# EAGLE schematic F7BNJ6PIJVPUCS8 (EAGLE 7.3.0)
COPYRIGHT: based on Transistortester (microcontroller.net); PROJECT_INFO: extented version with backlight dimmer; PROJECT_NAME: Component Tester
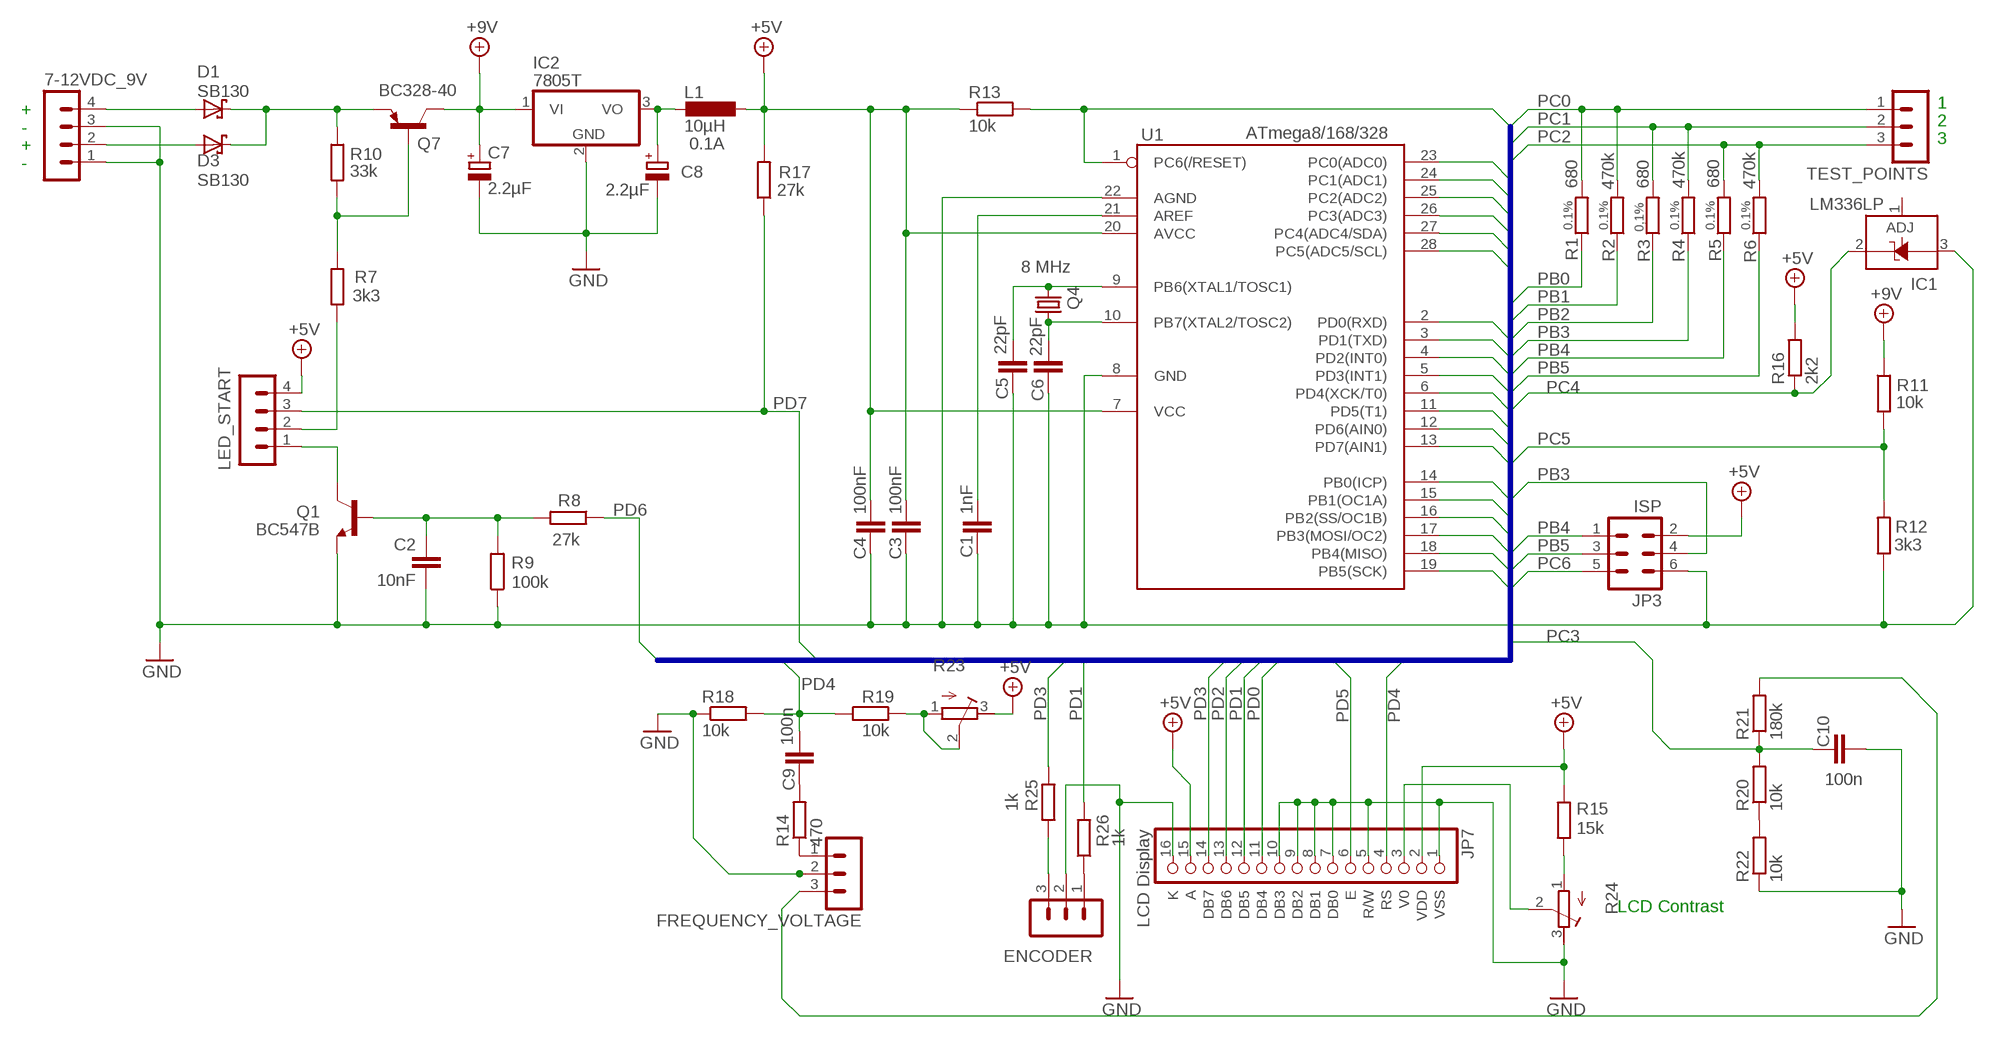
[diagram p0: schematic, sheet 1]

## Parts
7-12VDC_9V  MA04-1  [MA04-1]
C1  1nF  C2.5/2  [C2.5-2]
C2  10nF  C2,5-3  [C2.5-3]
C3  100nF  C-EU025-025X050  [C025-025X050]
C4  100nF  C-EU025-025X050  [C025-025X050]
C5  22pF  C2,5-3  [C2.5-3]
C6  22pF  C2,5-3  [C2.5-3]
C7  2.2µF  CPOL-EUE5-5  [E5-5]
C8  2.2µF  CPOL-EUE5-5  [E5-5]
C9  100n  C2,5-3  [C2.5-3]
C10  100n  C2,5-3  [C2.5-3]
D1  SB130  SCHOTTKY-DIODE_RAD3-5-A  [DIODE-3-5A-V]
D3  SB130  SCHOTTKY-DIODE_RAD3-5-A  [DIODE-3-5A-V]
ENCODER  MA03-1  [MA03-1]
FREQUENCY_VOLTAGE  MA03-1  [MA03-1]
IC1  LM336LP  [TO92]
IC2  7805T  [TO220H]
JP3  ISP  ML6  [ML6]
JP7  LCD Display  PINHD-1X16-LCD-TOP  [PINHD-1X16]
L1  10µH  L-EU0204/7  [0204/7]
LED_START  MA04-1  [MA04-1]
Q1  BC547B  [TO92]
Q4  8 MHz  CRYSTALHC49S  [HC49/S]
Q7  BC328-40  [TO92-EBC]
R1  680  R-EU_0207/10  [0207/10]
R2  470k  R-EU_0207/10  [0207/10]
R3  680  R-EU_0207/10  [0207/10]
R4  470k  R-EU_0207/10  [0207/10]
R5  680  R-EU_0207/10  [0207/10]
R6  470k  R-EU_0207/10  [0207/10]
R7  3k3  R-EU_0207/10  [0207/10]
R8  27k  R-EU_0204/7  [0204/7]
R9  100k  R-EU_0204/7  [0204/7]
R10  33k  R-EU_0207/2V  [0207/2V]
R11  10k  R-EU_0207/10  [0207/10]
R12  3k3  R-EU_0207/2V  [0207/2V]
R13  10k  R-EU_0207/10  [0207/10]
R14  470  R-EU_0207/10  [0207/10]
R15  15k  R-EU_0207/10  [0207/10]
R16  2k2  R-EU_0204/5  [0204/5]
R17  27k  R-EU_0207/7  [0207/7]
R18  10k  R-EU_0207/10  [0207/10]
R19  10k  R-EU_0207/10  [0207/10]
R20  10k  R-EU_0207/10  [0207/10]
R21  180k  R-EU_0207/10  [0207/10]
R22  10k  R-EU_0207/10  [0207/10]
R23  R-TRIMM3339P  [RTRIM3339P]
R24  R-TRIMM3339P  [RTRIM3339P]
R25  1k  R-EU_0204/7  [0204/7]
R26  1k  R-EU_0207/10  [0207/10]
TEST_POINTS  MA03-1  [MA03-1]
U1  ATmega8/168/328  MEGA8-P  [DIL28-3]

## Nets
+5V: C3.2 C4.1 JP3.2 JP7.2(VDD) JP7.15(A) L1.1 LED_START.4 R13.1 R15.1 R16.2 R17.2 R23.3(E) U1.7(VCC) U1.20(AVCC)
+9V: C7.+ IC2.1(VI) Q7.C R11.1
GND: 7-12VDC_9V.1 7-12VDC_9V.3 C1.1 C2.2 C3.1 C4.2 C5.1 C6.1 C7.- C8.- C10.1 ENCODER.2 FREQUENCY_VOLTAGE.2 IC1.3(A) IC2.2(GND) JP3.6 JP7.1(VSS) JP7.5(R/W) JP7.7(DB0) JP7.8(DB1) JP7.9(DB2) JP7.10(DB3) JP7.16(K) Q1.1(E) R9.1 R12.1 R18.1 R22.1 R24.3(E) U1.8(GND) U1.22(AGND)
N$1: R15.2 R24.1(A)
N$2: JP7.3(V0) R24.2(S)
N$3: FREQUENCY_VOLTAGE.1 R14.1
N$4: C9.1 R14.2
N$5: D1.C D3.C Q7.E R10.1
N$6: R19.2 R23.1(A) R23.2(S)
N$7: R20.1 R22.2
N$8: LED_START.1 Q1.3(C)
N$9: 7-12VDC_9V.4 D1.A
N$10: C1.2 U1.21(AREF)
N$11: ENCODER.3 R25.1
N$12: C5.2 Q4.2 U1.9(PB6(XTAL1/TOSC1))
N$13: C6.2 Q4.1 U1.10(PB7(XTAL2/TOSC2))
N$14: ENCODER.1 R26.1
N$15: FREQUENCY_VOLTAGE.3 R21.2
N$20: C8.+ IC2.3(VO) L1.2
N$22: 7-12VDC_9V.2 D3.A
N$33: Q7.B R7.2 R10.2
N$35: C2.1 Q1.2(B) R8.2 R9.2
PB0: R1.1 U1.14(PB0(ICP))
PB1: R2.1 U1.15(PB1(OC1A))
PB2: R3.1 U1.16(PB2(SS/OC1B))
PB3: JP3.4 R4.1 U1.17(PB3(MOSI/OC2))
PB4: JP3.1 R5.1 U1.18(PB4(MISO))
PB5: JP3.3 R6.1 U1.19(PB5(SCK))
PC0: R1.2 R2.2 TEST_POINTS.1 U1.23(PC0(ADC0))
PC1: R3.2 R4.2 TEST_POINTS.2 U1.24(PC1(ADC1))
PC2: R5.2 R6.2 TEST_POINTS.3 U1.25(PC2(ADC2))
PC3: C10.2 R20.2 R21.1 U1.26(PC3(ADC3))
PC4: IC1.2(C) R16.1 U1.27(PC4(ADC4/SDA))
PC5: R11.2 R12.2 U1.28(PC5(ADC5/SCL))
PC6: JP3.5 R13.2 U1.1(PC6(/RESET))
PD0: JP7.11(DB4) U1.2(PD0(RXD))
PD1: JP7.12(DB5) R26.2 U1.3(PD1(TXD))
PD2: JP7.13(DB6) U1.4(PD2(INT0))
PD3: JP7.14(DB7) R25.2 U1.5(PD3(INT1))
PD4: C9.2 JP7.4(RS) R18.2 R19.1 U1.6(PD4(XCK/T0))
PD5: JP7.6(E) U1.11(PD5(T1))
PD6: R8.1 U1.12(PD6(AIN0))
PD7: LED_START.3 R17.1 U1.13(PD7(AIN1))
START: LED_START.2 R7.1
Unconnected: IC1.1(ADJ)

## Buses
BUS1:PB[0..5],PC[0..6],PD[0..7]

## Notes on the sheet
- 1
- +
- 2
- -
- 3
- +
- -
- PC4
- PC3
- PD4
- LCD Contrast

## Library data of the parts
7-12VDC_9V LED_START = con-lstb:MA04-1: PIN HEADER; OC_FARNELL: unknown; OC_NEWARK: unknown
C1 C2 C5 C6 C9 C10 = capacitor-wima:C: CAPACITOR naming: grid - package width
C3 C4 = rcl:C-EU: CAPACITOR, European symbol
C7 C8 = rcl:CPOL-EU: POLARIZED CAPACITOR, European symbol
D1 D3 = markus:SCHOTTKY-DIODE: Schottky Diode
ENCODER FREQUENCY_VOLTAGE TEST_POINTS = con-lstb:MA03-1: PIN HEADER; OC_FARNELL: unknown; OC_NEWARK: unknown
IC1 = linear:LM336: 2.5-V INTEGRATED REFERENCE CIRCUITS LM236 Source: http://focus.ti.com/lit/ds/symlink/lm336-2.5.pdf
IC2 = linear:78*: Positive VOLTAGE REGULATOR Source: http://cache.national.com/ds/LM/LM78L05.pdf http://www.fairchildsemi.com/ds/LM/LM7805.pdf
JP3 = con-ml:ML6: HARTING; OC_FARNELL: unknown; OC_NEWARK: unknown
JP7 = markus:PINHD-1X16-LCD: Pin Header for LCD module 16 pin supports bottom and top types
L1 = rcl:L-EU: INDUCTOR, European symbol; CURRENT: 0.1A
Q1 = transistor-npn:BC547*: NPN Transistor
Q4 = crystal:CRYSTAL: CRYSTAL; OC_FARNELL: 1667008; OC_NEWARK: unknown
Q7 = transistor-pnp:BC328*: PNP Transistror
R1 R2 R4-R6 = resistor:R-EU_: RESISTOR, European symbol; TOLERANCE: 0.1%
R3 = resistor:R-EU_: RESISTOR, European symbol; TOLERANCE: 0,1%
R7 R10 R12-R15 R18-R22 = resistor:R-EU_: RESISTOR, European symbol
R8 R9 R11 R16 R17 R25 R26 = rcl:R-EU_: RESISTOR, European symbol
R23 R24 = rcl:R-TRIMM: Trimm resistor
U1 = avr-6:MEGA8-P: MICROCONTROLLER 8 Kbytes FLASH 1 kbytes SRAM 512 bytes EEPROM USART 4-channel 10 bit ADC 2-channel 8 bit ADC

## Net classes
0 default: width 0.406 mm, drill 0.8 mm